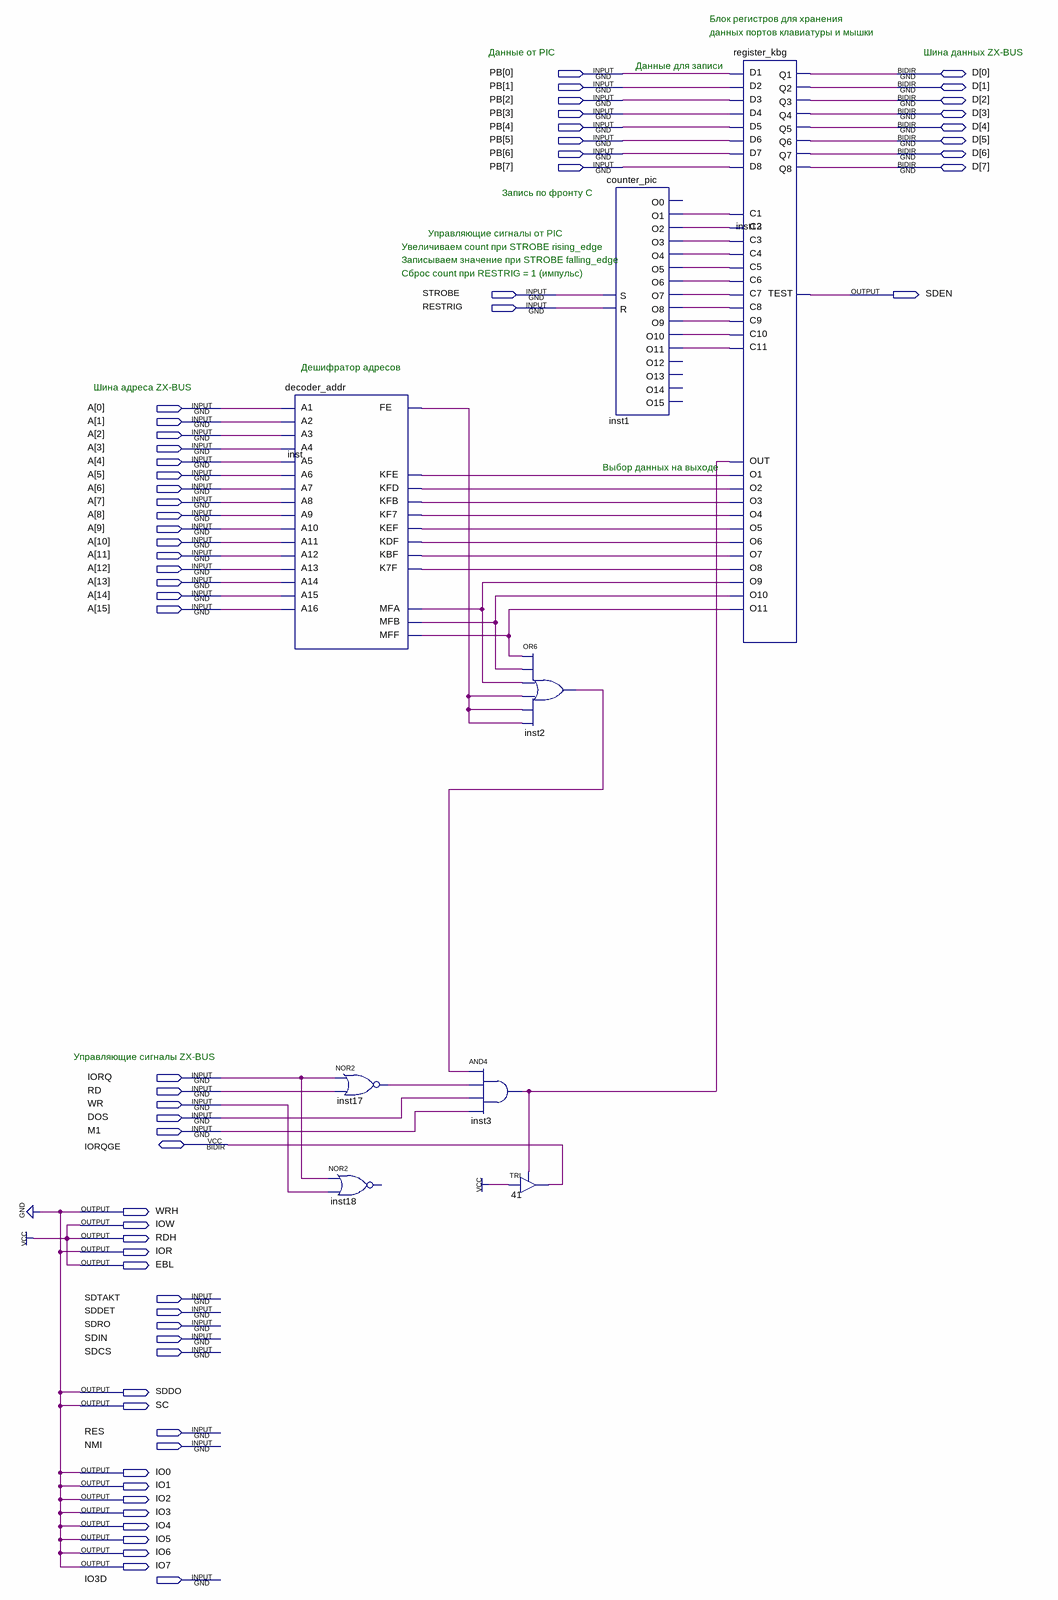
[diagram p0: schematic sheet]
// Quartus schematic zcontroller.bdf as structural Verilog: 8 symbols, 64 pins
module zcontroller (
  input  [7:0] PB,
  input  STROBE,
  input  RESTRIG,
  input  [15:0] A,
  input  IORQ,
  input  RD,
  input  WR,
  input  DOS,
  input  M1,
  input  SDTAKT,
  input  SDDET,
  input  SDRO,
  input  SDIN,
  input  SDCS,
  input  RES,
  input  NMI,
  input  IO3D,
  inout  [7:0] D,
  inout  IORQGE,
  output SDEN,
  output WRH,
  output IOW,
  output RDH,
  output IOR,
  output EBL,
  output SDDO,
  output SC,
  output IO0,
  output IO1,
  output IO2,
  output IO3,
  output IO4,
  output IO5,
  output IO6,
  output IO7
);

  wire inst1_o1, inst1_o2, inst1_o3, inst1_o4, inst1_o5, inst1_o6, inst1_o7, inst1_o8, inst1_o9, inst1_o10,
       inst1_o11, inst2_out, inst3_out, inst17_out, inst_fe, inst_k7f, inst_kbf, inst_kdf, inst_kef,
       inst_kf7, inst_kfb, inst_kfd, inst_kfe, inst_mfa, inst_mfb, inst_mff;

  decoder_addr inst (
    .A1(A[0]), .A2(A[1]), .A3(A[2]), .A4(A[3]), .A5(A[4]), .A6(A[5]), .A7(A[6]), .A8(A[7]), .A9(A[8]),
    .A10(A[9]), .A11(A[10]), .A12(A[11]), .A13(A[12]), .A14(A[13]), .A15(A[14]), .A16(A[15]), .FE(inst_fe),
    .KFB(inst_kfb), .KFD(inst_kfd), .KFE(inst_kfe), .KF7(inst_kf7), .KEF(inst_kef), .KDF(inst_kdf),
    .KBF(inst_kbf), .K7F(inst_k7f), .MFA(inst_mfa), .MFB(inst_mfb), .MFF(inst_mff));
  nor inst17 (inst17_out, IORQ, RD);
  // NOR2 inst18 has open pins: IN1=IORQ, IN2=WR, OUT=open
  and inst3 (inst3_out, inst2_out, inst17_out, DOS, M1);
  TRI u_41 (.IN(1'b1), .OE(inst3_out), .OUT(IORQGE));
  or inst2 (inst2_out, inst_mff, inst_mfb, inst_mfa, inst_fe, inst_fe, inst_fe);
  counter_pic inst1 (
    .S(STROBE), .R(RESTRIG), .O1(inst1_o1), .O2(inst1_o2), .O3(inst1_o3), .O4(inst1_o4), .O5(inst1_o5),
    .O6(inst1_o6), .O7(inst1_o7), .O8(inst1_o8), .O9(inst1_o9), .O10(inst1_o10), .O11(inst1_o11));  // open: O0, O12, O13, O14, O15
  register_kbg inst13 (
    .C2(inst1_o2), .C3(inst1_o3), .C1(inst1_o1), .D1(PB[0]), .D2(PB[1]), .D3(PB[2]), .D4(PB[3]), .D5(PB[4]),
    .D6(PB[5]), .D7(PB[6]), .D8(PB[7]), .C4(inst1_o4), .C5(inst1_o5), .C6(inst1_o6), .C7(inst1_o7),
    .C8(inst1_o8), .O1(inst_kfe), .O2(inst_kfd), .O3(inst_kfb), .O4(inst_kf7), .O5(inst_kef), .O6(inst_kdf),
    .O7(inst_kbf), .O8(inst_k7f), .O9(inst_mfa), .C9(inst1_o9), .OUT(inst3_out), .C10(inst1_o10),
    .C11(inst1_o11), .O10(inst_mfb), .O11(inst_mff), .Q1(D[0]), .Q2(D[1]), .Q3(D[2]), .Q4(D[3]), .Q5(D[4]),
    .Q6(D[5]), .Q7(D[6]), .Q8(D[7]), .TEST(SDEN));

  assign EBL = 1'b1;
  assign IO0 = 1'b0;
  assign IO1 = 1'b0;
  assign IO2 = 1'b0;
  assign IO3 = 1'b0;
  assign IO4 = 1'b0;
  assign IO5 = 1'b0;
  assign IO6 = 1'b0;
  assign IO7 = 1'b0;
  assign IOR = 1'b0;
  assign IOW = 1'b1;
  assign RDH = 1'b1;
  assign SC = 1'b0;
  assign SDDO = 1'b0;
  assign WRH = 1'b0;

  // Notes on the sheet:
  //   Блок регистров для хранения
  //   данных портов клавиатуры и мышки
  //   Данные от PIC
  //   Шина данных ZX-BUS
  //   Данные для записи
  //   Запись по фронту C
  //   Управляющие сигналы от PIC
  //   Увеличиваем count при STROBE rising_edge
  //   Записываем значение при STROBE falling_edge
  //   Сброс count при RESTRIG = 1 (импульс)
  //   Дешифратор адресов
  //   Шина адреса ZX-BUS
  //   Выбор данных на выходе
  //   Управляющие сигналы ZX-BUS
endmodule
